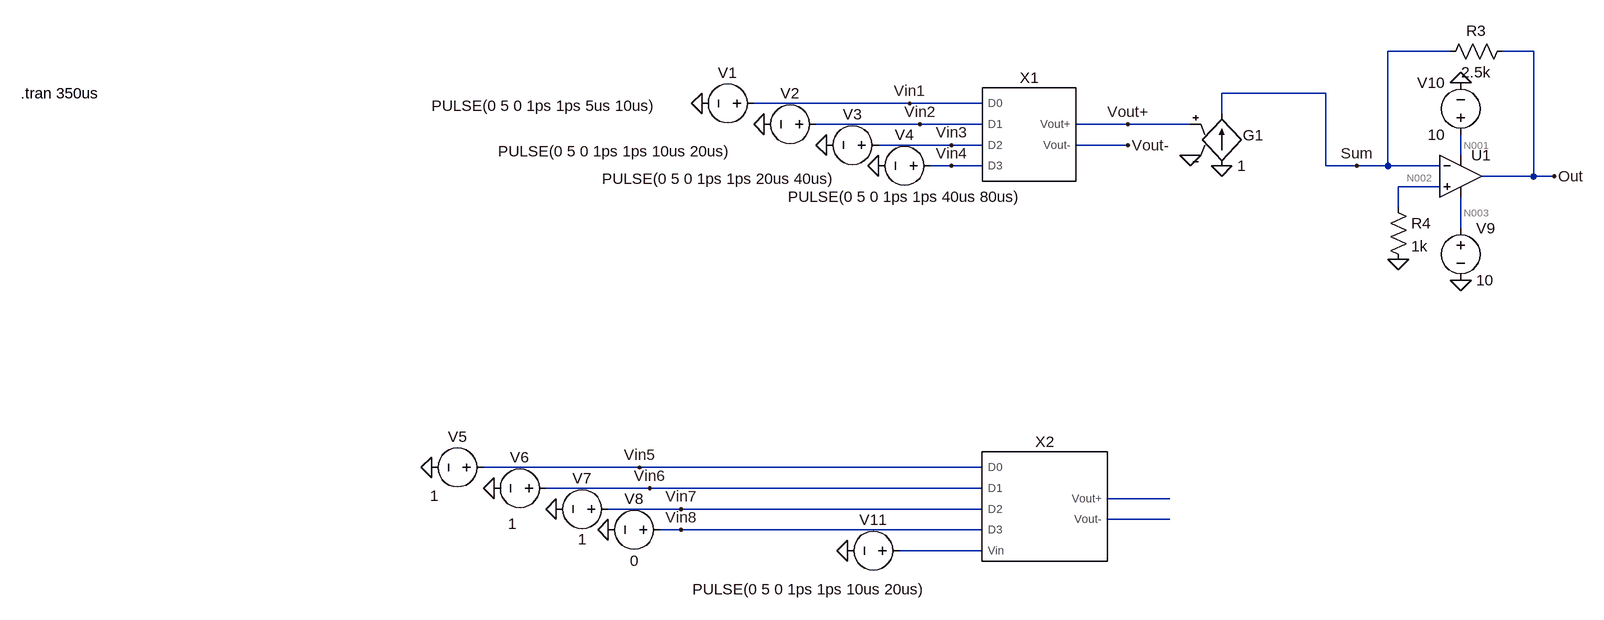
[diagram p0: schematic Perceptron.asc]
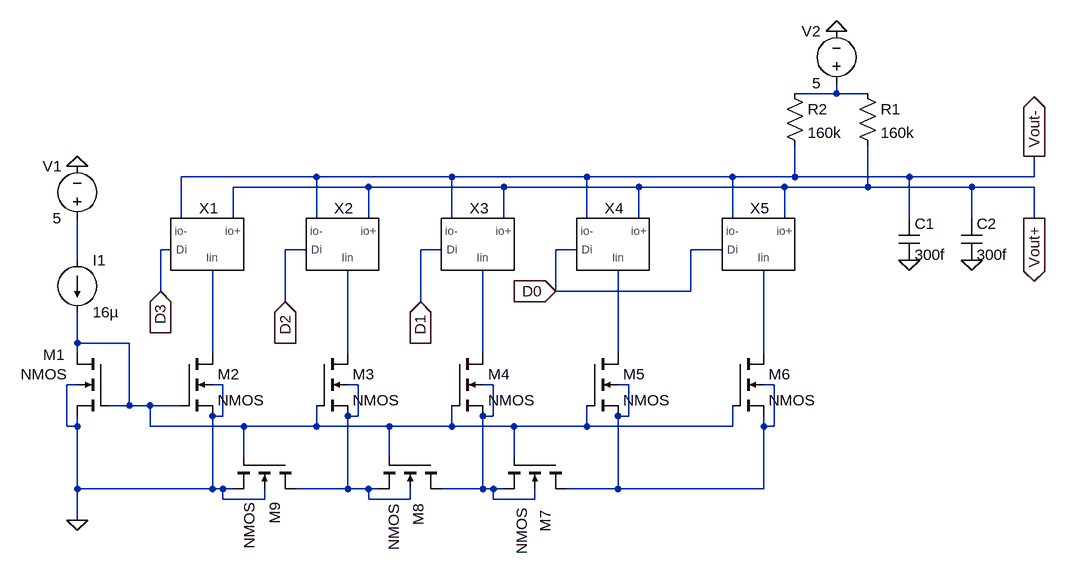
[diagram p1: sub-circuit 4_bit_dac.asc]
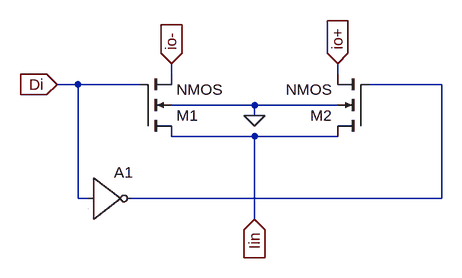
[diagram p2: sub-circuit differentialinput.asc]
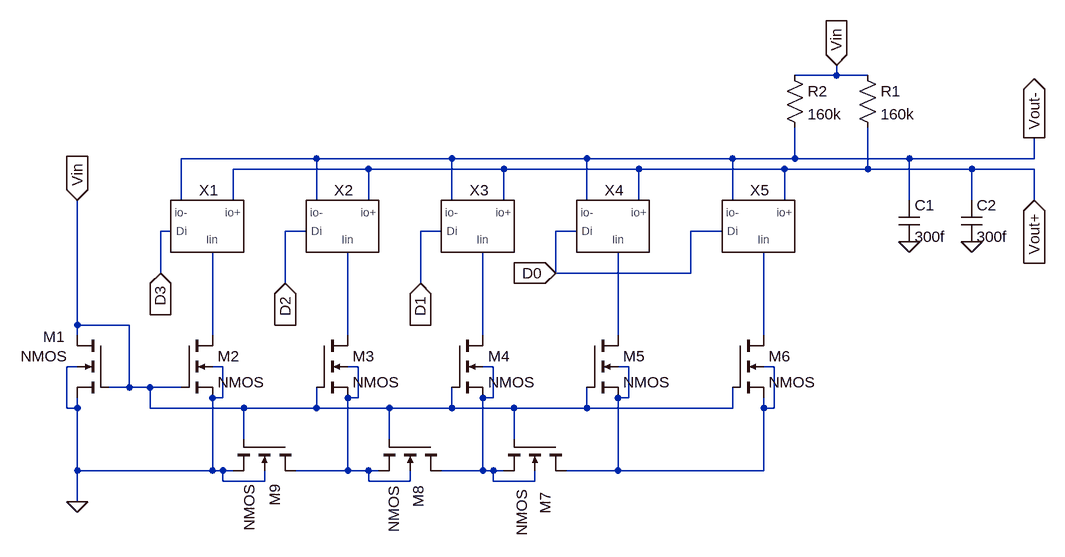
[diagram p3: sub-circuit 4_bit_dacv1.asc]
Perceptron.asc, the LTspice schematic file:
Version 4
SHEET 1 996 796
WIRE 656 -48 560 -48
WIRE 784 -48 736 -48
WIRE 464 16 304 16
WIRE -176 32 -416 32
WIRE -64 32 -176 32
WIRE 304 48 304 16
WIRE -160 64 -320 64
WIRE -64 64 -160 64
WIRE 160 64 80 64
WIRE 256 64 160 64
WIRE -112 96 -224 96
WIRE -64 96 -112 96
WIRE 160 96 80 96
WIRE 672 112 672 80
WIRE -112 128 -144 128
WIRE -64 128 -112 128
WIRE 464 128 464 16
WIRE 512 128 464 128
WIRE 560 128 560 -48
WIRE 560 128 512 128
WIRE 640 128 560 128
WIRE 784 144 784 -48
WIRE 784 144 704 144
WIRE 816 144 784 144
WIRE 640 160 576 160
WIRE 576 192 576 160
WIRE 672 224 672 176
WIRE -592 592 -832 592
WIRE -64 592 -592 592
WIRE -576 624 -736 624
WIRE -64 624 -576 624
WIRE 224 640 128 640
WIRE -528 656 -640 656
WIRE -64 656 -528 656
WIRE 224 672 128 672
WIRE -528 688 -560 688
WIRE -64 688 -528 688
WIRE -64 720 -192 720
FLAG -224 128 0
FLAG -304 96 0
FLAG -400 64 0
FLAG -496 32 0
FLAG -176 32 Vin1
FLAG -160 64 Vin2
FLAG -112 96 Vin3
FLAG -112 128 Vin4
FLAG 160 64 Vout+
FLAG 160 96 Vout-
FLAG 304 128 0
FLAG 256 112 0
FLAG 672 304 0
FLAG 672 0 0
FLAG 576 272 0
FLAG 512 128 Sum
FLAG 816 144 Out
FLAG -640 688 0
FLAG -720 656 0
FLAG -816 624 0
FLAG -912 592 0
FLAG -592 592 Vin5
FLAG -576 624 Vin6
FLAG -528 656 Vin7
FLAG -528 688 Vin8
FLAG -272 720 0
SYMBOL 4_Bit_DAC 0 80 R0
SYMATTR InstName X1
SYMBOL voltage -400 32 R90
WINDOW 0 -32 56 VBottom 2
WINDOW 3 -12 339 VTop 2
WINDOW 123 0 0 Left 0
WINDOW 39 0 0 Left 0
SYMATTR InstName V1
SYMATTR Value PULSE(0 5 0 1ps 1ps 5us 10us)
SYMBOL voltage -304 64 R90
WINDOW 0 -32 56 VBottom 2
WINDOW 3 26 326 VTop 2
WINDOW 123 0 0 Left 0
WINDOW 39 0 0 Left 0
SYMATTR InstName V2
SYMATTR Value PULSE(0 5 0 1ps 1ps 10us 20us)
SYMBOL voltage -208 96 R90
WINDOW 0 -32 56 VBottom 2
WINDOW 3 36 262 VTop 2
WINDOW 123 0 0 Left 0
WINDOW 39 0 0 Left 0
SYMATTR InstName V3
SYMATTR Value PULSE(0 5 0 1ps 1ps 20us 40us)
SYMBOL voltage -128 128 R90
WINDOW 0 -32 56 VBottom 2
WINDOW 3 32 56 VTop 2
WINDOW 123 0 0 Left 0
WINDOW 39 0 0 Left 0
SYMATTR InstName V4
SYMATTR Value PULSE(0 5 0 1ps 1ps 40us 80us)
SYMBOL g 304 32 R0
WINDOW 0 33 49 Left 2
SYMATTR InstName G1
SYMATTR Value 1
SYMBOL res 640 -32 R270
WINDOW 0 32 56 VTop 2
WINDOW 3 0 56 VBottom 2
SYMATTR InstName R3
SYMATTR Value 2.5k
SYMBOL voltage 672 208 R0
WINDOW 123 0 0 Left 0
WINDOW 39 0 0 Left 0
SYMATTR InstName V9
SYMATTR Value 10
SYMBOL voltage 672 96 R180
WINDOW 0 24 96 Left 2
WINDOW 3 24 16 Left 2
WINDOW 123 0 0 Left 0
WINDOW 39 0 0 Left 0
SYMATTR InstName V10
SYMATTR Value 10
SYMBOL res 560 176 R0
SYMATTR InstName R4
SYMATTR Value 1k
SYMBOL OpAmps\\UniversalOpAmp 672 144 R0
SYMATTR InstName U1
SYMBOL 4_Bit_DACV1 32 672 R0
SYMATTR InstName X2
SYMBOL voltage -816 592 R90
WINDOW 0 -32 56 VBottom 2
WINDOW 3 28 91 VTop 2
WINDOW 123 0 0 Left 0
WINDOW 39 0 0 Left 0
SYMATTR InstName V5
SYMATTR Value 1
SYMBOL voltage -720 624 R90
WINDOW 0 -32 56 VBottom 2
WINDOW 3 39 67 VTop 2
WINDOW 123 0 0 Left 0
WINDOW 39 0 0 Left 0
SYMATTR InstName V6
SYMATTR Value 1
SYMBOL voltage -624 656 R90
WINDOW 0 -32 56 VBottom 2
WINDOW 3 62 56 VBottom 2
WINDOW 123 0 0 Left 0
WINDOW 39 0 0 Left 0
SYMATTR InstName V7
SYMATTR Value 1
SYMBOL voltage -544 688 R90
WINDOW 0 -32 56 VBottom 2
WINDOW 3 32 56 VTop 2
WINDOW 123 0 0 Left 0
WINDOW 39 0 0 Left 0
SYMATTR InstName V8
SYMATTR Value 0
SYMBOL voltage -176 720 R90
WINDOW 0 -32 56 VBottom 2
WINDOW 3 44 155 VTop 2
WINDOW 123 0 0 Left 0
WINDOW 39 0 0 Left 0
SYMATTR InstName V11
SYMATTR Value PULSE(0 5 0 1ps 1ps 10us 20us)
TEXT -1544 16 Left 2 !.tran 350us

4_bit_dac.asc, the sub-circuit schematic file:
Version 4
SHEET 1 1652 696
WIRE 1216 -80 1216 -96
WIRE 1216 -80 1152 -80
WIRE 1264 -80 1216 -80
WIRE 416 48 208 48
WIRE 624 48 416 48
WIRE 832 48 624 48
WIRE 1056 48 832 48
WIRE 1152 48 1152 0
WIRE 1152 48 1056 48
WIRE 1328 48 1152 48
WIRE 1520 48 1520 16
WIRE 1520 48 1328 48
WIRE 496 64 288 64
WIRE 704 64 496 64
WIRE 912 64 704 64
WIRE 1136 64 912 64
WIRE 1264 64 1264 0
WIRE 1264 64 1136 64
WIRE 1424 64 1264 64
WIRE 1520 64 1424 64
WIRE 208 112 208 48
WIRE 288 112 288 64
WIRE 416 112 416 48
WIRE 496 112 496 64
WIRE 624 112 624 48
WIRE 704 112 704 64
WIRE 832 112 832 48
WIRE 912 112 912 64
WIRE 1056 112 1056 48
WIRE 1136 112 1136 64
WIRE 1328 112 1328 48
WIRE 1424 112 1424 64
WIRE 1520 112 1520 64
WIRE 192 160 176 160
WIRE 400 160 368 160
WIRE 608 160 576 160
WIRE 816 160 784 160
WIRE 1040 160 992 160
WIRE 48 176 48 112
WIRE 176 224 176 160
WIRE 784 224 784 160
WIRE 992 224 992 160
WIRE 992 224 784 224
WIRE 368 240 368 160
WIRE 576 240 576 160
WIRE 48 304 48 256
WIRE 128 304 48 304
WIRE 48 320 48 304
WIRE 256 320 256 192
WIRE 464 320 464 192
WIRE 672 320 672 192
WIRE 880 320 880 192
WIRE 1104 320 1104 192
WIRE 48 368 32 368
WIRE 272 368 256 368
WIRE 480 368 464 368
WIRE 688 368 672 368
WIRE 896 368 880 368
WIRE 1120 368 1104 368
WIRE 128 400 128 304
WIRE 128 400 96 400
WIRE 160 400 128 400
WIRE 208 400 160 400
WIRE 272 416 272 368
WIRE 272 416 256 416
WIRE 480 416 480 368
WIRE 480 416 464 416
WIRE 688 416 688 368
WIRE 688 416 672 416
WIRE 896 416 896 368
WIRE 896 416 880 416
WIRE 32 432 32 368
WIRE 48 432 48 416
WIRE 48 432 32 432
WIRE 160 432 160 400
WIRE 304 432 160 432
WIRE 416 432 416 400
WIRE 416 432 304 432
WIRE 528 432 416 432
WIRE 624 432 624 400
WIRE 624 432 528 432
WIRE 720 432 624 432
WIRE 832 432 832 400
WIRE 832 432 720 432
WIRE 1056 432 1056 400
WIRE 1056 432 832 432
WIRE 1104 432 1104 416
WIRE 1120 432 1120 368
WIRE 1120 432 1104 432
WIRE 304 480 304 432
WIRE 528 480 528 432
WIRE 720 480 720 432
WIRE 48 528 48 432
WIRE 256 528 256 416
WIRE 256 528 48 528
WIRE 272 528 256 528
WIRE 288 528 272 528
WIRE 464 528 464 416
WIRE 464 528 384 528
WIRE 496 528 464 528
WIRE 512 528 496 528
WIRE 672 528 672 416
WIRE 672 528 608 528
WIRE 688 528 672 528
WIRE 704 528 688 528
WIRE 880 528 880 416
WIRE 880 528 800 528
WIRE 1104 528 1104 432
WIRE 1104 528 880 528
WIRE 272 544 272 528
WIRE 336 544 336 528
WIRE 336 544 272 544
WIRE 496 544 496 528
WIRE 560 544 560 528
WIRE 560 544 496 544
WIRE 688 544 688 528
WIRE 752 544 752 528
WIRE 752 544 688 544
WIRE 48 576 48 528
FLAG 48 32 0
FLAG 784 224 D0
IOPIN 784 224 In
FLAG 576 240 D1
IOPIN 576 240 In
FLAG 368 240 D2
IOPIN 368 240 In
FLAG 176 224 D3
IOPIN 176 224 In
FLAG 1216 -176 0
FLAG 1328 176 0
FLAG 1424 176 0
FLAG 1520 16 Vout-
IOPIN 1520 16 Out
FLAG 1520 112 Vout+
IOPIN 1520 112 Out
FLAG 48 576 0
SYMBOL voltage 48 128 R180
WINDOW 0 24 96 Left 2
WINDOW 3 24 16 Left 2
WINDOW 123 0 0 Left 0
WINDOW 39 0 0 Left 0
SYMATTR InstName V1
SYMATTR Value 5
SYMBOL current 48 176 R0
WINDOW 123 0 0 Left 0
WINDOW 39 0 0 Left 0
SYMATTR InstName I1
SYMATTR Value 16µ
SYMBOL nmos4 96 320 M0
WINDOW 0 67 2 Left 2
WINDOW 3 63 32 Left 2
SYMATTR InstName M1
SYMATTR Value2 l=45n w=250n
SYMBOL nmos4 208 320 R0
SYMATTR InstName M2
SYMATTR Value2 l=45n w=200n
SYMBOL nmos4 416 320 R0
SYMATTR InstName M3
SYMATTR Value2 l=45n w=350n
SYMBOL nmos4 624 320 R0
SYMATTR InstName M4
SYMATTR Value2 l=45n w=350n
SYMBOL nmos4 832 320 R0
SYMATTR InstName M5
SYMATTR Value2 l=45n w=350n
SYMBOL nmos4 1056 320 R0
SYMATTR InstName M6
SYMATTR Value2 l=45n w=350n
SYMBOL nmos4 800 480 R90
WINDOW 0 81 32 Left 2
WINDOW 3 77 68 Left 2
SYMATTR InstName M7
SYMATTR Value2 l=45n w=300n
SYMBOL nmos4 608 480 R90
WINDOW 0 71 35 Left 2
WINDOW 3 71 73 Left 2
SYMATTR InstName M8
SYMATTR Value2 l=45n w=300n
SYMBOL nmos4 384 480 R90
WINDOW 0 69 32 Left 2
WINDOW 3 69 71 Left 2
SYMATTR InstName M9
SYMATTR Value2 l=45n w=300n
SYMBOL DifferentialInput 224 176 R0
SYMATTR InstName X1
SYMBOL DifferentialInput 432 176 R0
SYMATTR InstName X2
SYMBOL DifferentialInput 640 176 R0
SYMATTR InstName X3
SYMBOL DifferentialInput 848 176 R0
SYMATTR InstName X4
SYMBOL DifferentialInput 1072 176 R0
SYMATTR InstName X5
SYMBOL cap 1312 112 R0
SYMATTR InstName C1
SYMATTR Value 300f
SYMBOL cap 1408 112 R0
SYMATTR InstName C2
SYMATTR Value 300f
SYMBOL res 1248 -96 R0
SYMATTR InstName R1
SYMATTR Value 160k
SYMBOL res 1136 -96 R0
SYMATTR InstName R2
SYMATTR Value 160k
SYMBOL voltage 1216 -80 R180
WINDOW 0 24 96 Left 2
WINDOW 3 24 16 Left 2
WINDOW 123 0 0 Left 0
WINDOW 39 0 0 Left 0
SYMATTR InstName V2
SYMATTR Value 5

differentialinput.asc, the sub-circuit schematic file:
Version 4
SHEET 1 880 680
WIRE 192 32 192 16
WIRE 448 32 448 16
WIRE 48 48 16 48
WIRE 144 48 48 48
WIRE 608 48 496 48
WIRE 320 80 192 80
WIRE 448 80 320 80
WIRE 320 96 320 80
WIRE 320 128 192 128
WIRE 448 128 320 128
WIRE 48 224 48 48
WIRE 64 224 48 224
WIRE 608 224 608 48
WIRE 608 224 128 224
WIRE 320 256 320 128
FLAG 320 96 0
FLAG 16 48 Di
IOPIN 16 48 In
FLAG 320 256 Iin
IOPIN 320 256 In
FLAG 192 16 io-
IOPIN 192 16 In
FLAG 448 16 io+
IOPIN 448 16 In
SYMBOL Digital\\inv 64 160 R0
SYMATTR InstName A1
SYMBOL nmos4 144 128 M180
SYMATTR InstName M1
SYMATTR Value2 l=45n w=120n
SYMBOL nmos4 496 128 R180
SYMATTR InstName M2
SYMATTR Value2 l=120n w=45n

4_bit_dacv1.asc, the sub-circuit schematic file:
Version 4
SHEET 1 1652 696
WIRE 1216 -80 1216 -96
WIRE 1216 -80 1152 -80
WIRE 1264 -80 1216 -80
WIRE 416 48 208 48
WIRE 624 48 416 48
WIRE 832 48 624 48
WIRE 1056 48 832 48
WIRE 1152 48 1152 0
WIRE 1152 48 1056 48
WIRE 1328 48 1152 48
WIRE 1520 48 1520 16
WIRE 1520 48 1328 48
WIRE 496 64 288 64
WIRE 704 64 496 64
WIRE 912 64 704 64
WIRE 1136 64 912 64
WIRE 1264 64 1264 0
WIRE 1264 64 1136 64
WIRE 1424 64 1264 64
WIRE 1520 64 1424 64
WIRE 208 112 208 48
WIRE 288 112 288 64
WIRE 416 112 416 48
WIRE 496 112 496 64
WIRE 624 112 624 48
WIRE 704 112 704 64
WIRE 832 112 832 48
WIRE 912 112 912 64
WIRE 1056 112 1056 48
WIRE 1136 112 1136 64
WIRE 1328 112 1328 48
WIRE 1424 112 1424 64
WIRE 1520 112 1520 64
WIRE 192 160 176 160
WIRE 400 160 368 160
WIRE 608 160 576 160
WIRE 816 160 784 160
WIRE 1040 160 992 160
WIRE 176 224 176 160
WIRE 784 224 784 160
WIRE 992 224 992 160
WIRE 992 224 784 224
WIRE 368 240 368 160
WIRE 576 240 576 160
WIRE 48 304 48 112
WIRE 128 304 48 304
WIRE 48 320 48 304
WIRE 256 320 256 192
WIRE 464 320 464 192
WIRE 672 320 672 192
WIRE 880 320 880 192
WIRE 1104 320 1104 192
WIRE 48 368 32 368
WIRE 272 368 256 368
WIRE 480 368 464 368
WIRE 688 368 672 368
WIRE 896 368 880 368
WIRE 1120 368 1104 368
WIRE 128 400 128 304
WIRE 128 400 96 400
WIRE 160 400 128 400
WIRE 208 400 160 400
WIRE 272 416 272 368
WIRE 272 416 256 416
WIRE 480 416 480 368
WIRE 480 416 464 416
WIRE 688 416 688 368
WIRE 688 416 672 416
WIRE 896 416 896 368
WIRE 896 416 880 416
WIRE 32 432 32 368
WIRE 48 432 48 416
WIRE 48 432 32 432
WIRE 160 432 160 400
WIRE 304 432 160 432
WIRE 416 432 416 400
WIRE 416 432 304 432
WIRE 528 432 416 432
WIRE 624 432 624 400
WIRE 624 432 528 432
WIRE 720 432 624 432
WIRE 832 432 832 400
WIRE 832 432 720 432
WIRE 1056 432 1056 400
WIRE 1056 432 832 432
WIRE 1104 432 1104 416
WIRE 1120 432 1120 368
WIRE 1120 432 1104 432
WIRE 304 480 304 432
WIRE 528 480 528 432
WIRE 720 480 720 432
WIRE 48 528 48 432
WIRE 256 528 256 416
WIRE 256 528 48 528
WIRE 272 528 256 528
WIRE 288 528 272 528
WIRE 464 528 464 416
WIRE 464 528 384 528
WIRE 496 528 464 528
WIRE 512 528 496 528
WIRE 672 528 672 416
WIRE 672 528 608 528
WIRE 688 528 672 528
WIRE 704 528 688 528
WIRE 880 528 880 416
WIRE 880 528 800 528
WIRE 1104 528 1104 432
WIRE 1104 528 880 528
WIRE 272 544 272 528
WIRE 336 544 336 528
WIRE 336 544 272 544
WIRE 496 544 496 528
WIRE 560 544 560 528
WIRE 560 544 496 544
WIRE 688 544 688 528
WIRE 752 544 752 528
WIRE 752 544 688 544
WIRE 48 576 48 528
FLAG 784 224 D0
IOPIN 784 224 In
FLAG 576 240 D1
IOPIN 576 240 In
FLAG 368 240 D2
IOPIN 368 240 In
FLAG 176 224 D3
IOPIN 176 224 In
FLAG 1328 176 0
FLAG 1424 176 0
FLAG 1520 16 Vout-
IOPIN 1520 16 Out
FLAG 1520 112 Vout+
IOPIN 1520 112 In
FLAG 48 576 0
FLAG 48 112 Vin
IOPIN 48 112 In
FLAG 1216 -96 Vin
IOPIN 1216 -96 In
SYMBOL nmos4 96 320 M0
WINDOW 0 67 2 Left 2
WINDOW 3 63 32 Left 2
SYMATTR InstName M1
SYMATTR Value2 l=45n w=250n
SYMBOL nmos4 208 320 R0
SYMATTR InstName M2
SYMATTR Value2 l=45n w=200n
SYMBOL nmos4 416 320 R0
SYMATTR InstName M3
SYMATTR Value2 l=45n w=350n
SYMBOL nmos4 624 320 R0
SYMATTR InstName M4
SYMATTR Value2 l=45n w=350n
SYMBOL nmos4 832 320 R0
SYMATTR InstName M5
SYMATTR Value2 l=45n w=350n
SYMBOL nmos4 1056 320 R0
SYMATTR InstName M6
SYMATTR Value2 l=45n w=350n
SYMBOL nmos4 800 480 R90
WINDOW 0 81 32 Left 2
WINDOW 3 77 68 Left 2
SYMATTR InstName M7
SYMATTR Value2 l=45n w=300n
SYMBOL nmos4 608 480 R90
WINDOW 0 71 35 Left 2
WINDOW 3 71 73 Left 2
SYMATTR InstName M8
SYMATTR Value2 l=45n w=300n
SYMBOL nmos4 384 480 R90
WINDOW 0 69 32 Left 2
WINDOW 3 69 71 Left 2
SYMATTR InstName M9
SYMATTR Value2 l=45n w=300n
SYMBOL DifferentialInput 224 176 R0
SYMATTR InstName X1
SYMBOL DifferentialInput 432 176 R0
SYMATTR InstName X2
SYMBOL DifferentialInput 640 176 R0
SYMATTR InstName X3
SYMBOL DifferentialInput 848 176 R0
SYMATTR InstName X4
SYMBOL DifferentialInput 1072 176 R0
SYMATTR InstName X5
SYMBOL cap 1312 112 R0
SYMATTR InstName C1
SYMATTR Value 300f
SYMBOL cap 1408 112 R0
SYMATTR InstName C2
SYMATTR Value 300f
SYMBOL res 1248 -96 R0
SYMATTR InstName R1
SYMATTR Value 160k
SYMBOL res 1136 -96 R0
SYMATTR InstName R2
SYMATTR Value 160k

The netlist it stands for:
* Perceptron.asc
XX1 Vin1 Vin2 Vin3 Vin4 Vout+ Vout- 4_bit_dac
V1 Vin1 0 PULSE(0 5 0 1ps 1ps 5us 10us)
V2 Vin2 0 PULSE(0 5 0 1ps 1ps 10us 20us)
V3 Vin3 0 PULSE(0 5 0 1ps 1ps 20us 40us)
V4 Vin4 0 PULSE(0 5 0 1ps 1ps 40us 80us)
G1 0 Sum Vout+ 0 1
R3 Sum Out 2.5k
V9 N003 0 10
V10 N001 0 10
R4 N002 0 1k
XU1 N002 Sum N001 N003 Out level1 Avol=1Meg GBW=10Meg Vos=0 En=0 Enk=0 In=0 Ink=0 Rin=500Meg  ; pins In+ In- V+ V- OUT
XX2 Vin5 Vin6 Vin7 Vin8 N006 N004 N005 4_bit_dacv1
V5 Vin5 0 1
V6 Vin6 0 1
V7 Vin7 0 1
V8 Vin8 0 0
V11 N006 0 PULSE(0 5 0 1ps 1ps 10us 20us)

* block symbol definitions
.subckt 4_bit_dac D0 D1 D2 D3 Vout+ Vout-
V1 N002 0 5
I1 N002 N003 16µ
M1 N003 N003 0 0 NMOS l=45n w=250n
M2 N004 N003 0 0 NMOS l=45n w=200n
M3 N005 N003 N009 N009 NMOS l=45n w=350n
M4 N006 N003 N010 N010 NMOS l=45n w=350n
M5 N007 N003 N011 N011 NMOS l=45n w=350n
M6 N008 N003 N011 N011 NMOS l=45n w=350n
M7 N011 N003 N010 N010 NMOS l=45n w=300n
M8 N010 N003 N009 N009 NMOS l=45n w=300n
M9 N009 N003 0 0 NMOS l=45n w=300n
XX1 D3 N004 Vout+ Vout- differentialinput
XX2 D2 N005 Vout+ Vout- differentialinput
XX3 D1 N006 Vout+ Vout- differentialinput
XX4 D0 N007 Vout+ Vout- differentialinput
XX5 D0 N008 Vout+ Vout- differentialinput
C1 Vout- 0 300f
C2 Vout+ 0 300f
R1 N001 Vout+ 160k
R2 N001 Vout- 160k
V2 N001 0 5
.ends 4_bit_dac

.subckt differentialinput Di Iin io+ io-
A1 Di 0 0 0 0 N001 0 0 BUF
M1 Iin Di io- 0 NMOS l=45n w=120n
M2 Iin N001 io+ 0 NMOS l=120n w=45n
.ends differentialinput

.subckt 4_bit_dacv1 D0 D1 D2 D3 Vin Vout+ Vout-
M1 Vin Vin 0 0 NMOS l=45n w=250n
M2 N001 Vin 0 0 NMOS l=45n w=200n
M3 N002 Vin N006 N006 NMOS l=45n w=350n
M4 N003 Vin N007 N007 NMOS l=45n w=350n
M5 N004 Vin N008 N008 NMOS l=45n w=350n
M6 N005 Vin N008 N008 NMOS l=45n w=350n
M7 N008 Vin N007 N007 NMOS l=45n w=300n
M8 N007 Vin N006 N006 NMOS l=45n w=300n
M9 N006 Vin 0 0 NMOS l=45n w=300n
XX1 D3 N001 Vout+ Vout- differentialinput
XX2 D2 N002 Vout+ Vout- differentialinput
XX3 D1 N003 Vout+ Vout- differentialinput
XX4 D0 N004 Vout+ Vout- differentialinput
XX5 D0 N005 Vout+ Vout- differentialinput
C1 Vout- 0 300f
C2 Vout+ 0 300f
R1 Vin Vout+ 160k
R2 Vin Vout- 160k
.ends 4_bit_dacv1

.model NMOS NMOS
.model PMOS PMOS
.lib standard.mos
.tran 350us
.lib UniversalOpAmp1.lib
.backanno
.end

* Results of the author's LTspice run, read from the files saved beside the schematic
* Operating Point, zero values left out:
*   V(vout-) = 5 V
*   V(vout+) = 3.254 V
*   V(sum) = 8.155 mV
*   V(out) = -8.135 kV
*   V(n003) = 10 V
*   V(n001) = 10 V
*   V(n002) = 20 µV
*   V(vin7) = 1 V
*   V(vin6) = 1 V
*   V(vin5) = 1 V
*   I(R3) = 3.254 A
*   I(R4) = 20 nA
*   I(G1) = 3.254 A
*   I(V9) = -19.99 nA
*   I(V10) = -19.99 nA
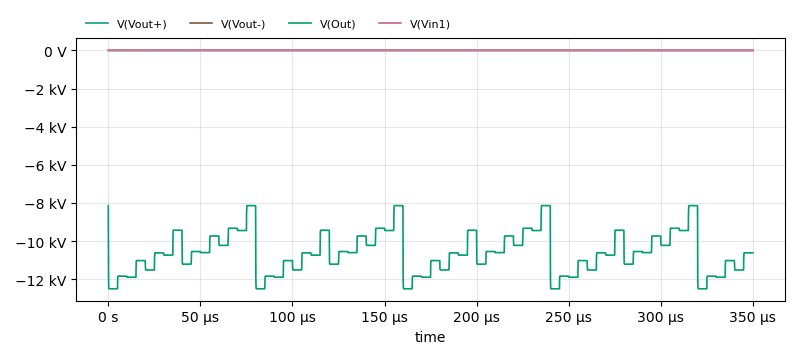
[diagram p4: Transient Analysis of Perceptron.asc, plotted from the saved traces]
* Transient Analysis, 1 run:
*   V(Vout+): min 3.254 V, max 5 V, average 4.254 V, rms 4.276 V, last 4.246 V
*   V(Vout-): min 970.2 mV, max 5 V, average 2.731 V, rms 2.987 V, last 2.266 V
*   V(Out): min -12.5 kV, max -8.135 kV, average -10.63 kV, rms 10.69 kV, last -10.61 kV
*   V(Vin1): min 0 V, max 5 V, average 2.5 V, rms 3.536 V, last 0 V